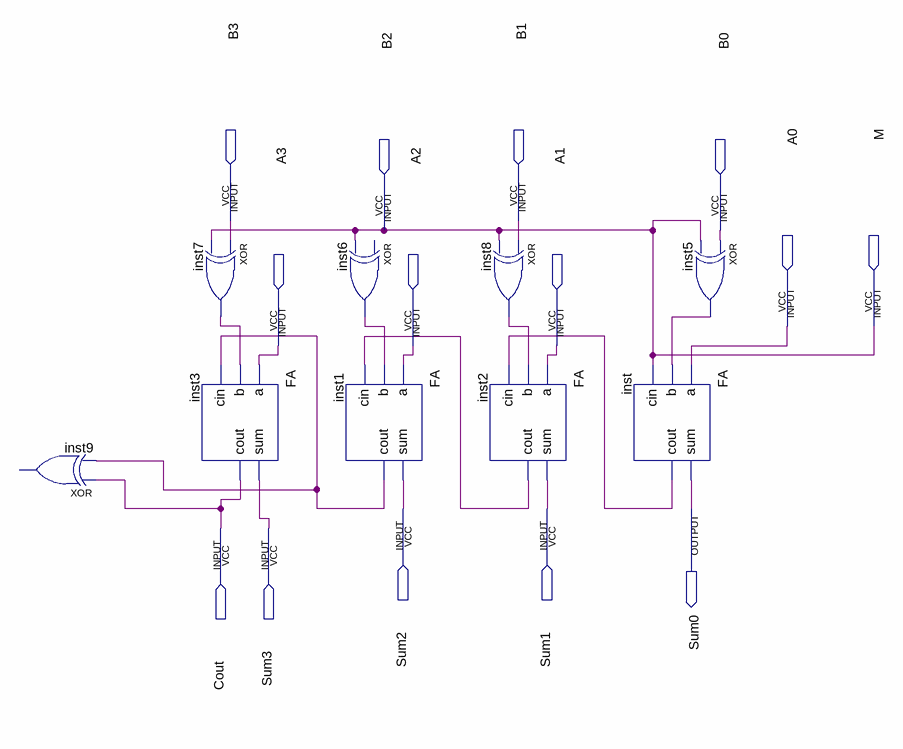
[diagram p0: schematic sheet]
// Quartus schematic FAblock.bdf as structural Verilog: 9 symbols, 14 pins
module FAblock (
  input  B3,
  input  B1,
  input  B2,
  input  B0,
  input  A0,
  input  M,
  input  A3,
  input  A2,
  input  A1,
  input  Sum2,
  input  Sum1,
  input  Cout,
  input  Sum3,
  output Sum0
);

  wire inst1_cout, inst2_cout, inst5_out, inst6_out, inst7_out, inst8_out, inst_cout;

  // XOR inst9 has open pins: IN1=Cout, IN2=inst1_cout, OUT=open
  xor inst7 (inst7_out, B3, B2);
  FA inst3 (.a(A3), .b(inst7_out), .cin(inst1_cout), .sum(Sum3), .cout(Cout));
  buf inst6 (inst6_out, B2);  // XOR open: IN1
  FA inst1 (.a(A2), .b(inst6_out), .cin(inst2_cout), .sum(Sum2), .cout(inst1_cout));
  xor inst8 (inst8_out, B1, B2);
  FA inst2 (.a(A1), .b(inst8_out), .cin(inst_cout), .sum(Sum1), .cout(inst2_cout));
  xor inst5 (inst5_out, B0, B2);
  FA inst (.a(A0), .b(inst5_out), .cin(B2), .sum(Sum0), .cout(inst_cout));

  assign M = B2;
endmodule
